# Altium schematic sheet ZhangXue.SchDoc
size A2
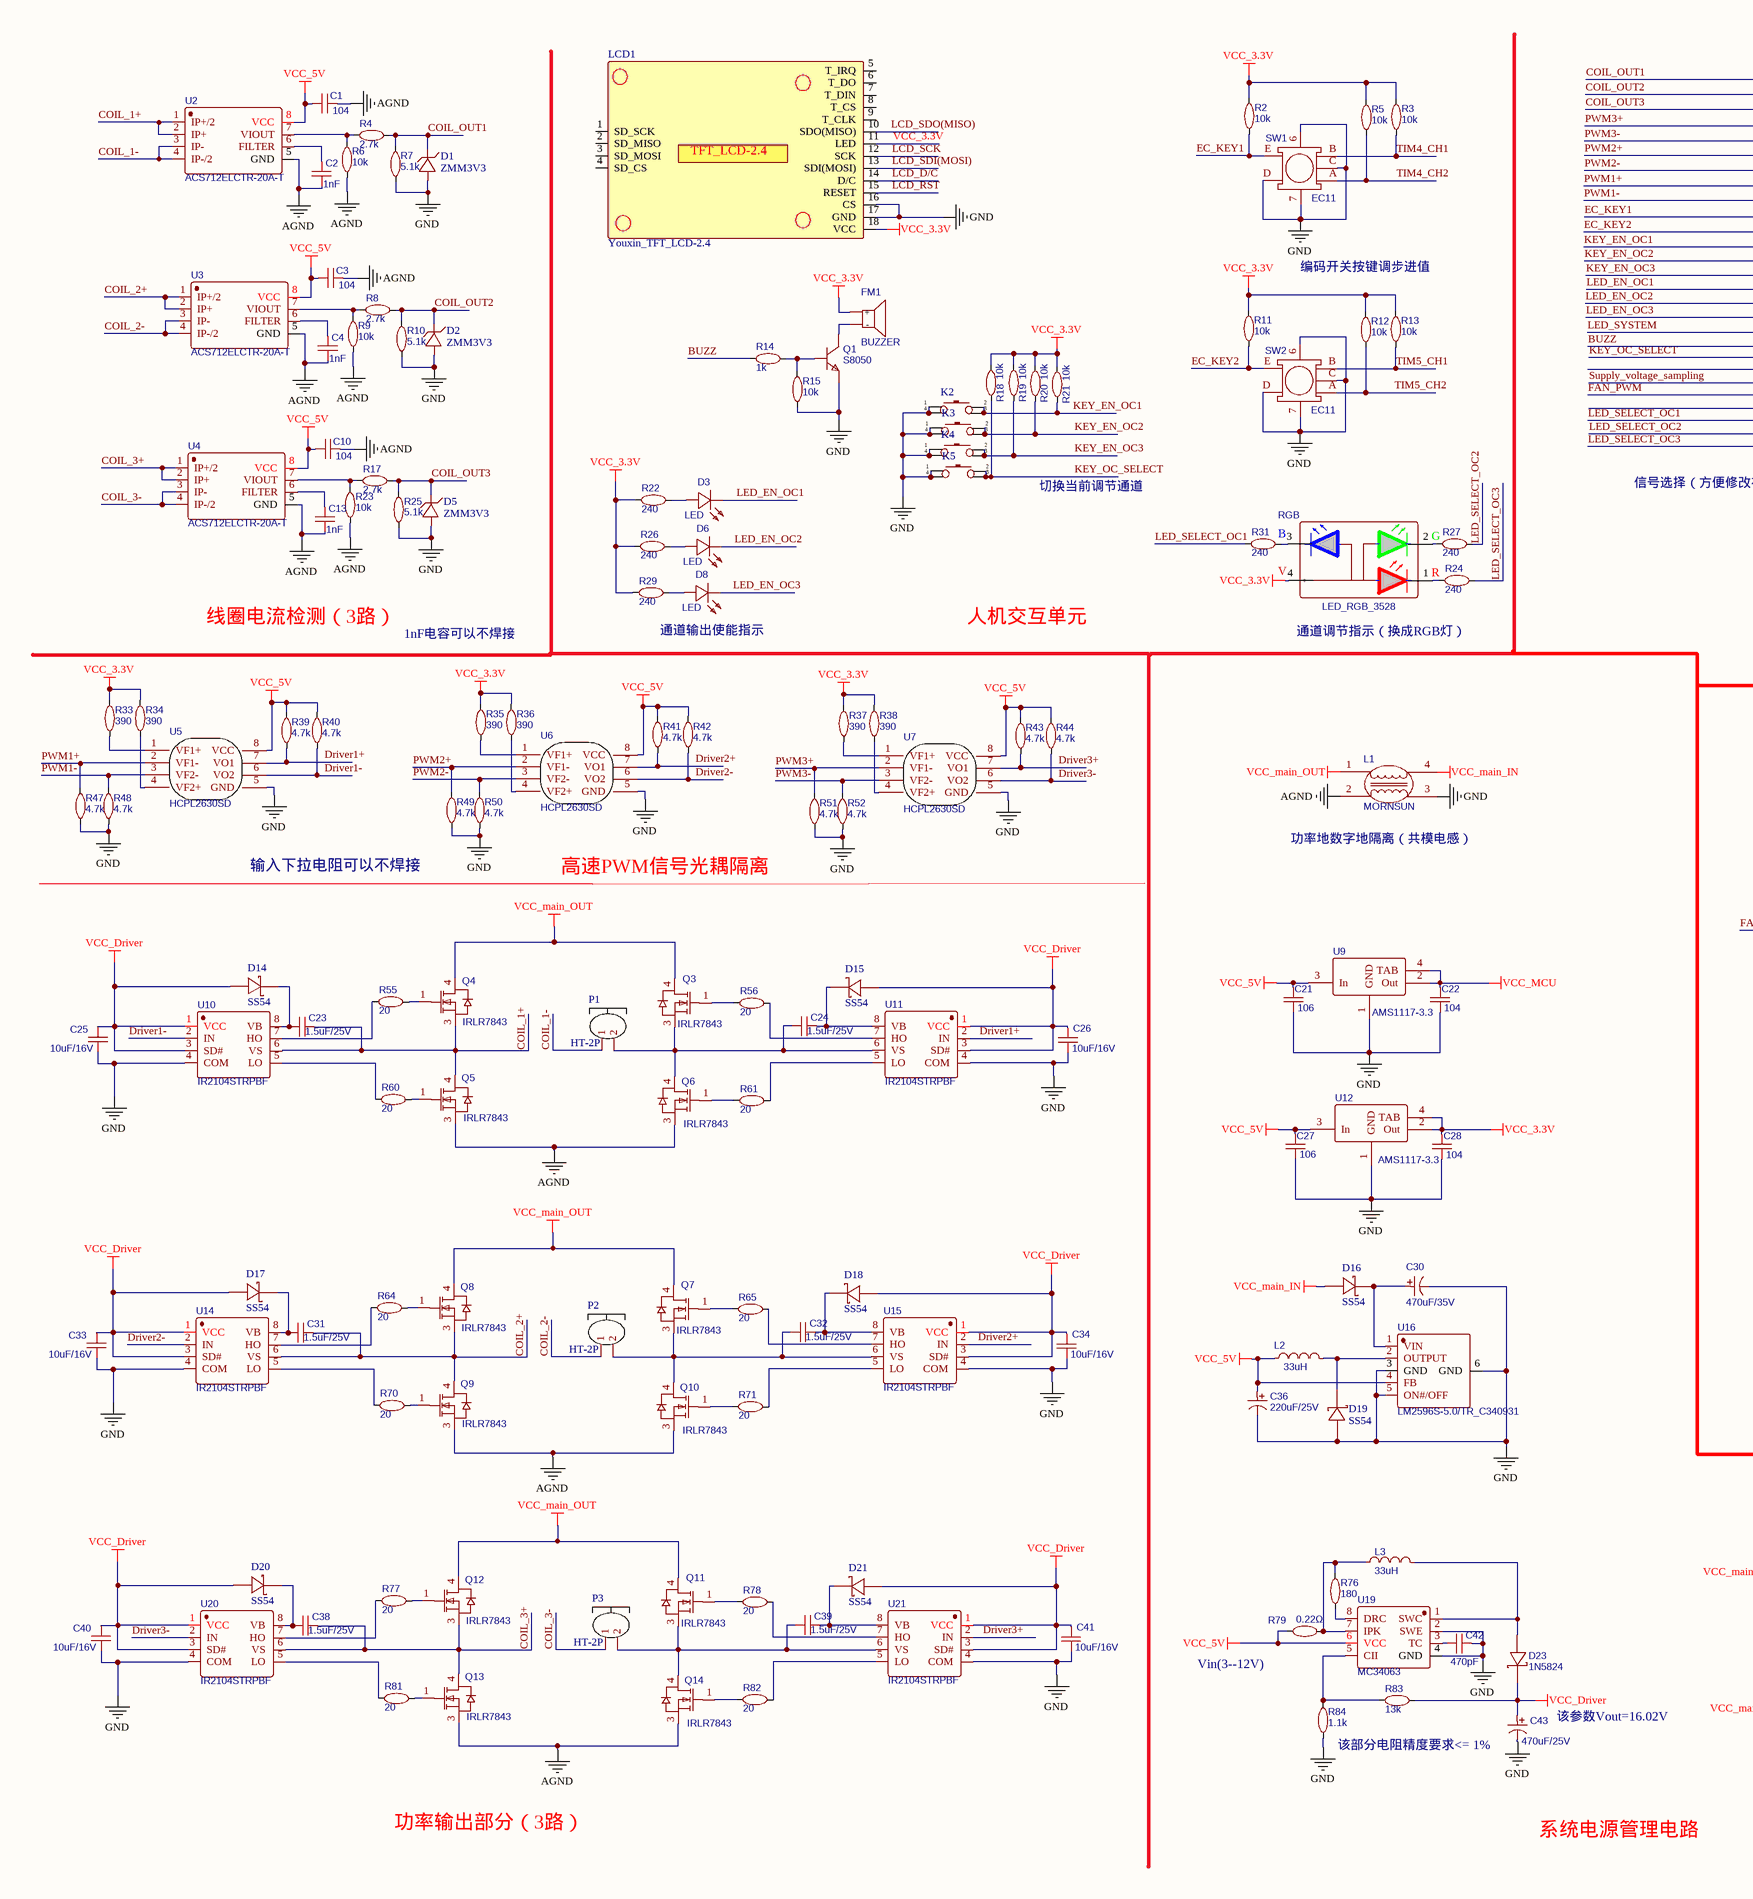
[diagram p0: ZhangXue.SchDoc, left]
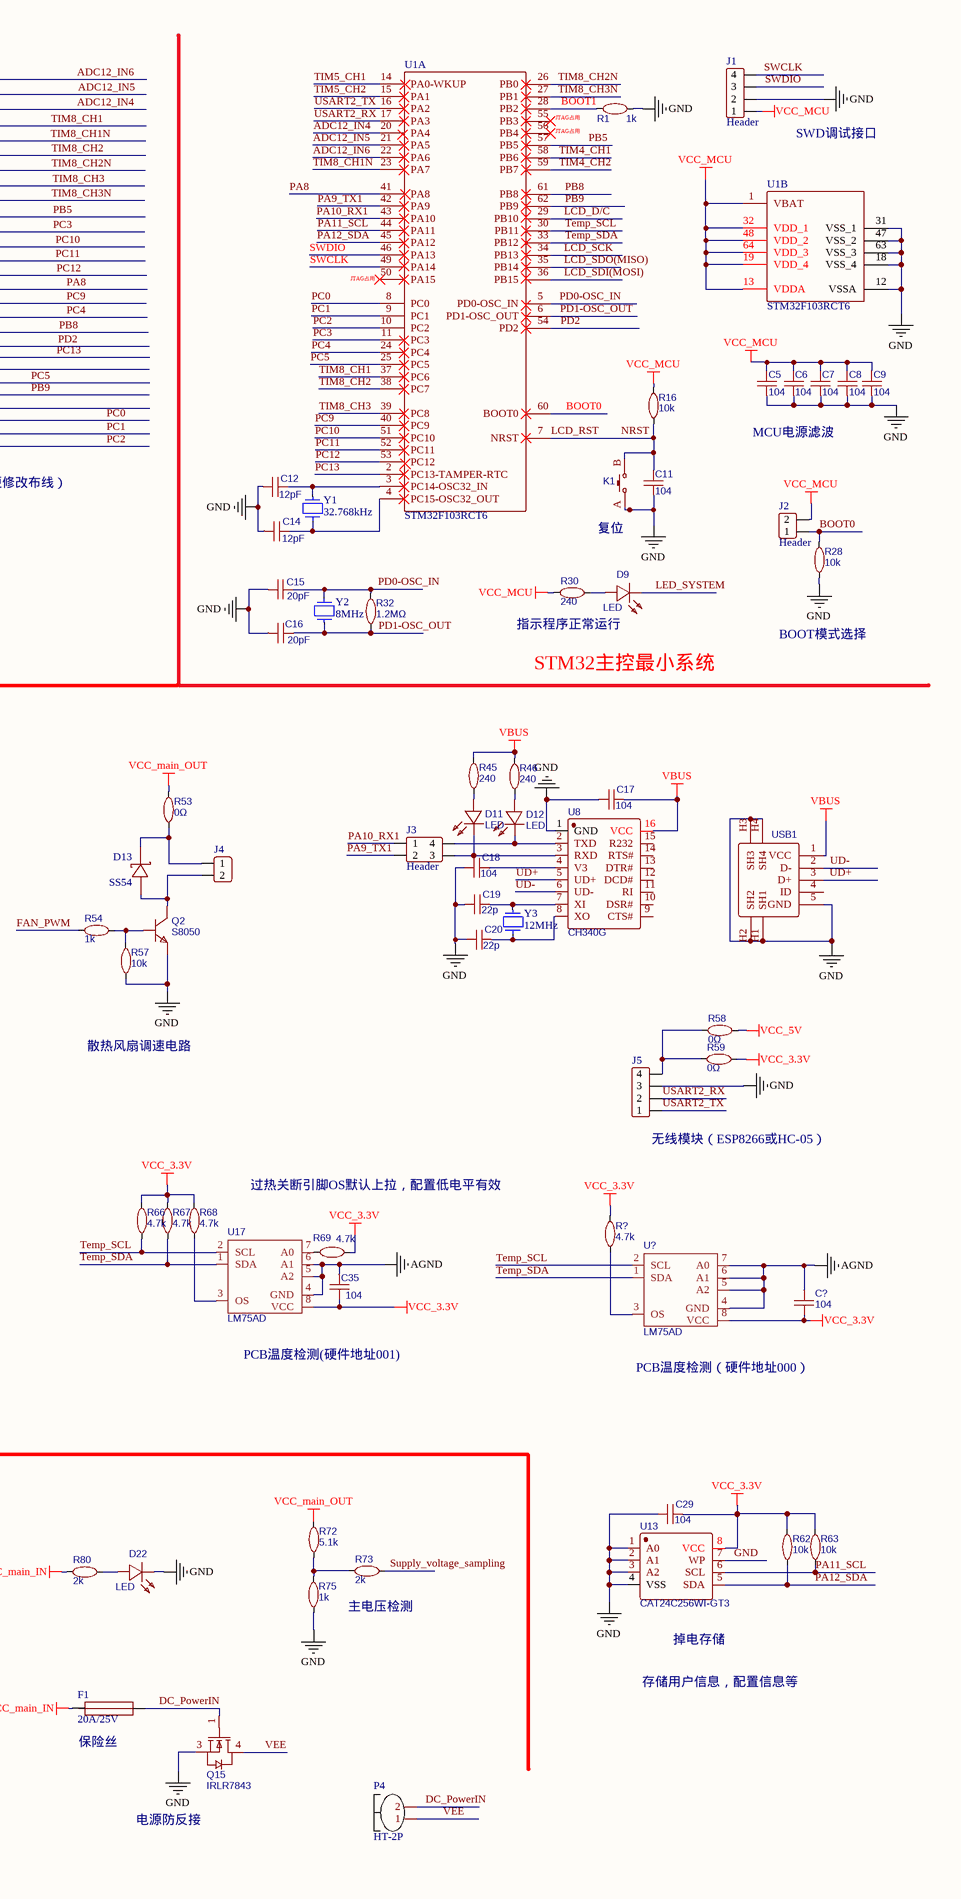
[diagram p1: ZhangXue.SchDoc, right]

## Parts
C1  104  [CAP_0603]
C2  1nF  [CAP_0603]
C3  104  [CAP_0603]
C4  1nF  [CAP_0603]
C5  104  [CAP_0603]
C6  104  [CAP_0603]
C7  104  [CAP_0603]
C8  104  [CAP_0603]
C9  104  [CAP_0603]
C10  104  [CAP_0603]
C11  104  [CAP_0603]
C12  12pF  [CAP_0603]
C13  1nF  [CAP_0603]
C14  12pF  [CAP_0603]
C15  20pF  [CAP_0603]
C16  20pF  [CAP_0603]
C17  104  [CAP_0603]
C18  104  [CAP_0603]
C19  22p  [CAP_0603]
C20  22p  [CAP_0603]
C21  106  [CAP_0603]
C22  104  [CAP_0603]
C23  1.5uF/25V  [CAP_0603]
C24  1.5uF/25V  [CAP_0603]
C25  10uF/16V  [CAP_0603]
C26  10uF/16V  [CAP_0603]
C27  106  [CAP_0603]
C28  104  [CAP_0603]
C29  104  [CAP_0603]
C30  470uF/35V  [CAPE_SMD_G_10.6]
C31  1.5uF/25V  [CAP_0603]
C32  1.5uF/25V  [CAP_0603]
C33  10uF/16V  [CAP_0603]
C34  10uF/16V  [CAP_0603]
C35  104  [CAP_0603]
C36  220uF/25V  [CAPE_SMD_F_8.4]
C38  1.5uF/25V  [CAP_0603]
C39  1.5uF/25V  [CAP_0603]
C40  10uF/16V  [CAP_0603]
C41  10uF/16V  [CAP_0603]
C42  470pF  [CAP_0805]
C43  470uF/25V  [CAPE_SMD_G_10.6]
C?  104  [CAP_0603]
D1  ZMM3V3  [LL34]
D2  ZMM3V3  [LL34]
D3  LED  [LED_0603_B]
D5  ZMM3V3  [LL34]
D6  LED  [LED_0603_B]
D8  LED  [LED_0603_B]
D9  LED  [LED_0603_B]
D11  LED  [LED_0603_B]
D12  LED  [LED_0603_B]
D13  SS54  [SOD-323]
D14  SS54  [SOD-323]
D15  SS54  [SOD-323]
D16  SS54  [DO214_SMA]
D17  SS54  [SOD-323]
D18  SS54  [SOD-323]
D19  SS54  [SOD-323]
D20  SS54  [SOD-323]
D21  SS54  [SOD-323]
D22  LED  [LED_0603_B]
D23  1N5824  [DO214_SMA]
F1  20A/25V  [FUSE-L]
FM1  BUZZER  [BUZZ-12*7.5]
J1  Header  [Header 2.54X4]
J2  Header  [Header 2.54X2]
J3  Header  [Header 2.54_2x2]
J4  Header  [HX2.54-2]  (value not drawn)
J5  Header 2.54_4  [Header F 2.54X4]  (value not drawn)
K1  TS-Button_2P  [SW_SMD_6.1*3.7]  (value not drawn)
K2  DIP-Button_4P  [TSW DIP-6*6*6]  (value not drawn)
K3  DIP-Button_4P  [TSW DIP-6*6*6]  (value not drawn)
K4  DIP-Button_4P  [TSW DIP-6*6*6]  (value not drawn)
K5  DIP-Button_4P  [TSW DIP-6*6*6]  (value not drawn)
L1  MORNSUN  [Inductor_Pin4]
L2  33uH  [Inductor_CDRH127R]
L3  33uH  [Inductor_CD_75]
LCD1  Youxin_TFT_LCD-2.4  [Youxin_TFT_LCD-2.4]
P1  HT-2P  [HT508-2P-H]
P2  HT-2P  [HT508-2P-H]
P3  HT-2P  [HT508-2P-H]
P4  HT-2P  [HT508-2P]
Q1  S8050  [SOT-23-3]
Q2  S8050  [SOT-23-3]
Q3  IRLR7843  [TO-252-2]
Q4  IRLR7843  [TO-252-2]
Q5  IRLR7843  [TO-252-2]
Q6  IRLR7843  [TO-252-2]
Q7  IRLR7843  [TO-252-2]
Q8  IRLR7843  [TO-252-2]
Q9  IRLR7843  [TO-252-2]
Q10  IRLR7843  [TO-252-2]
Q11  IRLR7843  [TO-252-2]
Q12  IRLR7843  [TO-252-2]
Q13  IRLR7843  [TO-252-2]
Q14  IRLR7843  [TO-252-2]
Q15  IRLR7843  [TO-252-2]
R1  1k  [RES_0603]
R2  10k  [RES_0603]
R3  10k  [RES_0603]
R4  2.7k  [RES_0603]
R5  10k  [RES_0603]
R6  10k  [RES_0603]
R7  5.1k  [RES_0603]
R8  2.7k  [RES_0603]
R9  10k  [RES_0603]
R10  5.1k  [RES_0603]
R11  10k  [RES_0603]
R12  10k  [RES_0603]
R13  10k  [RES_0603]
R14  1k  [RES_0603]
R15  10k  [RES_0603]
R16  10k  [RES_0603]
R17  2.7k  [RES_0603]
R18  10k  [RES_0603]
R19  10k  [RES_0603]
R20  10k  [RES_0603]
R21  10k  [RES_0603]
R22  240  [RES_0603]
R23  10k  [RES_0603]
R24  240  [RES_0603]
R25  5.1k  [RES_0603]
R26  240  [RES_0603]
R27  240  [RES_0603]
R28  10k  [RES_0603]
R29  240  [RES_0603]
R30  240  [RES_0603]
R31  240  [RES_0603]
R32  1.2MΩ  [RES_0603]
R33  390  [RES_0603]
R34  390  [RES_0603]
R35  390  [RES_0603]
R36  390  [RES_0603]
R37  390  [RES_0603]
R38  390  [RES_0603]
R39  4.7k  [RES_0603]
R40  4.7k  [RES_0603]
R41  4.7k  [RES_0603]
R42  4.7k  [RES_0603]
R43  4.7k  [RES_0603]
R44  4.7k  [RES_0603]
R45  240  [RES_0603]
R46  240  [RES_0603]
R47  4.7k  [RES_0603]
R48  4.7k  [RES_0603]
R49  4.7k  [RES_0603]
R50  4.7k  [RES_0603]
R51  4.7k  [RES_0603]
R52  4.7k  [RES_0603]
R53  0Ω  [RES_0603]
R54  1k  [RES_0603]
R55  20  [RES_0603]
R56  20  [RES_0603]
R57  10k  [RES_0603]
R58  0Ω  [RES_0603]
R59  0Ω  [RES_0603]
R60  20  [RES_0603]
R61  20  [RES_0603]
R62  10k  [RES_0603]
R63  10k  [RES_0603]
R64  20  [RES_0603]
R65  20  [RES_0603]
R66  4.7k  [RES_0603]
R67  4.7k  [RES_0603]
R68  4.7k  [RES_0603]
R69  4.7k  [RES_0603]
R70  20  [RES_0603]
R71  20  [RES_0603]
R72  5.1k  [RES_0603]
R73  2k  [RES_0603]
R75  1k  [RES_0603]
R76  180  [RES_0603]
R77  20  [RES_0603]
R78  20  [RES_0603]
R79  0.22Ω  [RES_0603]
R80  2k  [RES_0603]
R81  20  [RES_0603]
R82  20  [RES_0603]
R83  13k  [RES_0603]
R84  1.1k  [RES_0603]
R?  4.7k  [RES_0603]
RGB  LED_RGB_3528  [LED_3528_RGB]
SW1  EC11  [SW_EC11]
SW2  EC11  [SW_EC11]
U1  STM32F103RCT6  [LQFP_64_10X10]  (parts A,B of 2)
U2  ACS712ELCTR-20A-T  [SOIC-8_150MIL]
U3  ACS712ELCTR-20A-T  [SOIC-8_150MIL]
U4  ACS712ELCTR-20A-T  [SOIC-8_150MIL]
U5  HCPL2630SD  [SOP8_2_54]
U6  HCPL2630SD  [SOP8_2_54]
U7  HCPL2630SD  [SOP8_2_54]
U8  CH340G  [SOP-16]
U9  AMS1117-3.3  [SOT-223_3]
U10  IR2104STRPBF  [SOIC-8_150MIL]
U11  IR2104STRPBF  [SOIC-8_150MIL]
U12  AMS1117-3.3  [SOT-223_3]
U13  CAT24C256WI-GT3  [SOIC-8_150MIL]
U14  IR2104STRPBF  [SOIC-8_150MIL]
U15  IR2104STRPBF  [SOIC-8_150MIL]
U16  LM2596S-5.0/TR_C340931  [TO-263_5]
U17  LM75AD  [SOIC-8_150MIL]
U19  MC34063  [SOIC-8_150MIL]
U20  IR2104STRPBF  [SOIC-8_150MIL]
U21  IR2104STRPBF  [SOIC-8_150MIL]
U?  LM75AD  [SOIC-8_150MIL]
USB1  USB  [USB_Micro_DIP41]  (value not drawn)
Y1  32.768kHz  [X3215]
Y2  8MHz  [OSC-SMD_L5.0-W3.2]
Y3  12MHz  [XTAL1]

## Nets
AGND: C1.2 C2.1 C3.2 C4.1 C10.2 C13.1 C35.2 C?.2 L1.2 Q5.3(S) Q6.3(S) Q9.3(S) Q10.3(S) Q13.3(S) Q14.3(S) R6.1 R9.1 R23.1 U2.5(GND) U3.5(GND) U4.5(GND) U17.4(GND) U17.5(A2) U17.6(A1) U?.4(GND) U?.5(A2) U?.6(A1) U?.7(A0)
GND: C5.2 C6.2 C7.2 C8.2 C9.2 C11.2 C12.2 C14.2 C15.2 C16.2 C17.1 C18.1 C19.1 C20.1 C21.1 C22.1 C25.1 C26.1 C27.1 C28.1 C29.1 C30.2 C33.1 C34.1 C36.2 C40.1 C41.1 C42.2 C43.2 D1.1(A) D2.1(A) D5.1(A) D19.1(A) D22.C J1.2 J5.3 K1.A K2.1 K2.4 K3.1 K3.4 K4.1 K4.4 K5.1 K5.4 L1.3 LCD1.16(CS) LCD1.17(GND) Q1.2(E) Q2.2(E) Q15.3(S) R1.1 R7.2 R10.2 R15.2 R25.2 R28.2 R47.2 R48.2 R49.2 R50.2 R51.2 R52.2 R57.2 R75.1 R84.1 SW1.6 SW1.7 SW1.C SW1.D SW2.6 SW2.7 SW2.C SW2.D U1.12(VSSA) U1.18(VSS_4) U1.31(VSS_1) U1.47(VSS_2) U1.63(VSS_3) U5.5(GND) U6.5(GND) U7.5(GND) U8.1(GND) U9.1(GND) U10.4(COM) U11.4(COM) U12.1(GND) U13.1(A0) U13.2(A1) U13.3(A2) U13.4(VSS) U13.7(WP) U14.4(COM) U15.4(COM) U16.3(GND) U16.5(ON#/OFF) U16.6(GND) U19.2(SWE) U19.4(GND) U20.4(COM) U21.4(COM) USB1.5(GND) USB1.H1(SH1) USB1.H2(SH2) USB1.H3(SH3) USB1.H4(SH4)
VBUS: C17.2 R45.2 R46.2 U8.16(VCC) USB1.1(VCC)
VCC_3.3V: C28.2 C29.2 C35.1 C?.1 FM1.1(+) LCD1.11(LED) LCD1.18(VCC) R2.1 R3.1 R5.1 R11.1 R12.1 R13.1 R18.1 R19.1 R20.1 R21.1 R22.1 R26.1 R29.1 R33.1 R34.1 R35.1 R36.1 R37.1 R38.1 R59.1 R62.2 R63.2 R66.2 R67.2 R68.2 R69.1 R?.2 RGB.4 U12.2(Out) U12.4(TAB) U13.8(VCC) U17.8(VCC) U?.8(VCC)
VCC_5V: C1.1 C3.1 C10.1 C21.2 C27.2 C36.1 L2.1 R39.1 R40.1 R41.1 R42.1 R43.1 R44.1 R58.1 R79.2 U2.8(VCC) U3.8(VCC) U4.8(VCC) U5.8(VCC) U6.8(VCC) U7.8(VCC) U9.3(In) U12.3(In) U16.4(FB) U19.6(VCC)
VCC_Driver: C25.2 C26.2 C33.2 C34.2 C40.2 C41.2 C43.1 D14.1(A) D15.1(A) D17.1(A) D18.1(A) D20.1(A) D21.1(A) D23.2(C) R83.2 U10.1(VCC) U10.3(SD#) U11.1(VCC) U11.3(SD#) U14.1(VCC) U14.3(SD#) U15.1(VCC) U15.3(SD#) U20.1(VCC) U20.3(SD#) U21.1(VCC) U21.3(SD#)
VCC_main_IN: D16.1(A) F1.2 L1.4 R80.1
VCC_main_OUT: L1.1 Q3.4(D) Q4.4(D) Q7.4(D) Q8.4(D) Q11.4(D) Q12.4(D) R53.2 R72.2
VCC_MCU: C5.1 C6.1 C7.1 C8.1 C9.1 C22.2 J1.1 J2.2 R16.2 R30.1 U1.1(VBAT) U1.13(VDDA) U1.19(VDD_4) U1.32(VDD_1) U1.48(VDD_2) U1.64(VDD_3) U9.2(Out) U9.4(TAB)
ADC12_IN4: D5.2(C) R17.1 R25.1 U1.20(PA4)  [also labelled COIL_OUT3]
ADC12_IN5: D2.2(C) R8.1 R10.1 U1.21(PA5)  [also labelled COIL_OUT2]
ADC12_IN6: D1.2(C) R4.1 R7.1 U1.22(PA6)  [also labelled COIL_OUT1]
BOOT0: J2.1 R28.1 U1.60(BOOT0)
BOOT1: R1.2 U1.28(PB2)
BUZZ: R14.1 U1.54(PD2)  [also labelled PD2]
COIL_1+: C23.2 Q4.3(S) Q5.4(D) U2.1(IP+/2) U2.2(IP+) U10.6(VS)
COIL_1-: P1.1 U2.3(IP-) U2.4(IP-/2)
COIL_2+: C31.2 Q8.3(S) Q9.4(D) U3.1(IP+/2) U3.2(IP+) U14.6(VS)
COIL_2-: P2.1 U3.3(IP-) U3.4(IP-/2)
COIL_3+: C38.2 Q12.3(S) Q13.4(D) U4.1(IP+/2) U4.2(IP+) U20.6(VS)
COIL_3-: P3.1 U4.3(IP-) U4.4(IP-/2)
DC_PowerIN: F1.1 P4.2 Q15.1(G)
Driver1+: R39.2 U5.7(VO1) U11.2(IN)
Driver1-: R40.2 U5.6(VO2) U10.2(IN)
Driver2+: R41.2 U6.7(VO1) U15.2(IN)
Driver2-: R42.2 U6.6(VO2) U14.2(IN)
Driver3+: R43.2 U7.7(VO1) U21.2(IN)
Driver3-: R44.2 U7.6(VO2) U20.2(IN)
EC_KEY1: R2.2 SW1.E U1.57(PB5)  [also labelled PB5]
EC_KEY2: R11.2 SW2.E U1.11(PC3)  [also labelled PC3]
FAN_PWM: R54.1 U1.62(PB9)  [also labelled PB9]
KEY_EN_OC1: K2.2 K2.3 R21.2 U1.51(PC10)  [also labelled PC10]
KEY_EN_OC2: K3.2 K3.3 R20.2 U1.52(PC11)  [also labelled PC11]
KEY_EN_OC3: K4.2 K4.3 R19.2 U1.53(PC12)  [also labelled PC12]
KEY_OC_SELECT: K5.2 K5.3 R18.2 U1.2(PC13-TAMPER-RTC)  [also labelled PC13]
LCD_D/C: LCD1.14(D/C) U1.29(PB10)
LCD_RST: C11.1 K1.B LCD1.15(RESET) R16.1 U1.7(NRST)  [also labelled NRST]
LCD_SCK: LCD1.12(SCK) U1.34(PB13)
LCD_SDI(MOSI): LCD1.13(SDI(MOSI)) U1.36(PB15)
LCD_SDO(MISO): LCD1.10(SDO(MISO)) U1.35(PB14)
LED_EN_OC1: D3.C U1.41(PA8)  [also labelled PA8]
LED_EN_OC2: D6.C U1.40(PC9)  [also labelled PC9]
LED_EN_OC3: D8.C U1.24(PC4)  [also labelled PC4]
LED_SELECT_OC1: R31.1 U1.8(PC0)  [also labelled PC0]
LED_SELECT_OC2: R27.2 U1.9(PC1)  [also labelled PC1]
LED_SELECT_OC3: R24.2 U1.10(PC2)  [also labelled PC2]
LED_SYSTEM: D9.C U1.61(PB8)  [also labelled PB8]
PA9_TX1: J3.2 U1.42(PA9)
PA10_RX1: J3.1 U1.43(PA10)
PA11_SCL: R63.1 U1.44(PA11) U13.6(SCL)
PA12_SDA: R62.1 U1.45(PA12) U13.5(SDA)
PC5: R73.1 U1.25(PC5)  [also labelled Supply_voltage_sampling]
PD0-OSC_IN: C15.1 R32.1 U1.5(PD0-OSC_IN) Y2.2
PD1-OSC_OUT: C16.1 R32.2 U1.6(PD1-OSC_OUT) Y2.1
PWM1+: R47.1 U1.39(PC8) U5.2(VF1-)  [also labelled TIM8_CH3]
PWM1-: R48.1 U1.27(PB1) U5.3(VF2-)  [also labelled TIM8_CH3N]
PWM2+: R49.1 U1.38(PC7) U6.2(VF1-)  [also labelled TIM8_CH2]
PWM2-: R50.1 U1.26(PB0) U6.3(VF2-)  [also labelled TIM8_CH2N]
PWM3+: R51.1 U1.37(PC6) U7.2(VF1-)  [also labelled TIM8_CH1]
PWM3-: R52.1 U1.23(PA7) U7.3(VF2-)  [also labelled TIM8_CH1N]
SWCLK: J1.4 U1.49(PA14)
SWDIO: J1.3 U1.46(PA13)
Temp_SCL: R66.1 U1.30(PB11) U17.2(SCL) U?.2(SCL)
Temp_SDA: R67.1 U1.33(PB12) U17.1(SDA) U?.1(SDA)
TIM4_CH1: R3.2 SW1.B U1.58(PB6)
TIM4_CH2: R5.2 SW1.A U1.59(PB7)
TIM5_CH1: R13.2 SW2.B U1.14(PA0-WKUP)
TIM5_CH2: R12.2 SW2.A U1.15(PA1)
UD+: U8.5(UD+) USB1.3(D+)
UD-: U8.6(UD-) USB1.2(D-)
USART2_RX: J5.2 U1.17(PA3)
USART2_TX: J5.1 U1.16(PA2)
VEE: P4.1 Q15.4(D)
NetC2_2: C2.2 U2.6(FILTER)
NetC4_2: C4.2 U3.6(FILTER)
NetC12_1: C12.1 U1.3(PC14-OSC32_IN) Y1.1
NetC13_2: C13.2 U4.6(FILTER)
NetC14_1: C14.1 U1.4(PC15-OSC32_OUT) Y1.2
NetC18_2: C18.2 U8.4(V3)
NetC19_2: C19.2 U8.7(XI) Y3.1
NetC20_2: C20.2 U8.8(XO) Y3.2
NetC23_1: C23.1 D14.2(C) U10.8(VB)
NetC24_1: C24.1 P1.2 Q3.3(S) Q6.4(D) U11.6(VS)
NetC24_2: C24.2 D15.2(C) U11.8(VB)
NetC30_1: C30.1 D16.2(C) U16.1(VIN)
NetC31_1: C31.1 D17.2(C) U14.8(VB)
NetC32_1: C32.1 P2.2 Q7.3(S) Q10.4(D) U15.6(VS)
NetC32_2: C32.2 D18.2(C) U15.8(VB)
NetC38_1: C38.1 D20.2(C) U20.8(VB)
NetC39_1: C39.1 P3.2 Q11.3(S) Q14.4(D) U21.6(VS)
NetC39_2: C39.2 D21.2(C) U21.8(VB)
NetC42_1: C42.1 U19.3(TC)
NetD3_A: D3.A R22.2
NetD6_A: D6.A R26.2
NetD8_A: D8.A R29.2
NetD9_A: D9.A R30.2
NetD11_A: D11.A R45.1
NetD11_C: D11.C J3.3 U8.3(RXD)
NetD12_A: D12.A R46.1
NetD12_C: D12.C J3.4 U8.2(TXD)
NetD13_1: D13.1(A) J4.2 Q2.3(C)
NetD13_2: D13.2(C) J4.1 R53.1
NetD19_2: D19.2(C) L2.2 U16.2(OUTPUT)
NetD22_A: D22.A R80.2
NetD23_1: D23.1(A) L3.2 U19.1(SWC)
NetFM1_2: FM1.2(－) Q1.3(C)
NetJ5_4: J5.4 R58.2 R59.2
NetL3_1: L3.1 R76.2 R79.1 U19.7(IPK)
NetQ1_1: Q1.1(B) R14.2 R15.1
NetQ2_1: Q2.1(B) R54.2 R57.1
NetQ3_1: Q3.1(G) R56.2
NetQ4_1: Q4.1(G) R55.1
NetQ5_1: Q5.1(G) R60.1
NetQ6_1: Q6.1(G) R61.2
NetQ7_1: Q7.1(G) R65.2
NetQ8_1: Q8.1(G) R64.1
NetQ9_1: Q9.1(G) R70.1
NetQ10_1: Q10.1(G) R71.2
NetQ11_1: Q11.1(G) R78.2
NetQ12_1: Q12.1(G) R77.1
NetQ13_1: Q13.1(G) R81.1
NetQ14_1: Q14.1(G) R82.2
NetR4_2: R4.2 R6.2 U2.7(VIOUT)
NetR8_2: R8.2 R9.2 U3.7(VIOUT)
NetR17_2: R17.2 R23.2 U4.7(VIOUT)
NetR24_1: R24.1 RGB.1
NetR27_1: R27.1 RGB.2
NetR31_2: R31.2 RGB.3
NetR33_2: R33.2 U5.1(VF1+)
NetR34_2: R34.2 U5.4(VF2+)
NetR35_2: R35.2 U6.1(VF1+)
NetR36_2: R36.2 U6.4(VF2+)
NetR37_2: R37.2 U7.1(VF1+)
NetR38_2: R38.2 U7.4(VF2+)
NetR55_2: R55.2 U10.7(HO)
NetR56_1: R56.1 U11.7(HO)
NetR60_2: R60.2 U10.5(LO)
NetR61_1: R61.1 U11.5(LO)
NetR64_2: R64.2 U14.7(HO)
NetR65_1: R65.1 U15.7(HO)
NetR68_1: R68.1 U17.3(OS)
NetR69_2: R69.2 U17.7(A0)
NetR70_2: R70.2 U14.5(LO)
NetR71_1: R71.1 U15.5(LO)
NetR72_1: R72.1 R73.2 R75.2
NetR76_1: R76.1 U19.8(DRC)
NetR77_2: R77.2 U20.7(HO)
NetR78_1: R78.1 U21.7(HO)
NetR81_2: R81.2 U20.5(LO)
NetR82_1: R82.1 U21.5(LO)
NetR83_1: R83.1 R84.2 U19.5(CII)
NetR?_1: R?.1 U?.3(OS)

Not connected (* = marked no-connect by the designer): LCD1 1(SD_SCK) 2(SD_MISO) 3(SD_MOSI) 4(SD_CS) 5(T_IRQ) 6(T_DO) 7(T_DIN) 8(T_CS) 9(T_CLK); U1 50(PA15)* 55(PB3)* 56(PB4)*; U8 9(CTS#) 10(DSR#) 11(RI) 12(DCD#) 13(DTR#) 14(RTS#) 15(R232); USB1 4(ID)

## Notes on the sheet
- JTAG占用
- SWD调试接口
- 编码开关按键调步进值
- (near U1) JTAG占用
- MCU电源滤波
- 切换当前调节通道
- 信号选择（方便修改布线）
- (near K1) 复位
- 线圈电流检测（3路）
- 1nF电容可以不焊接
- 通道输出使能指示
- 人机交互单元
- (near RGB) 通道调节指示（换成RGB灯）
- (near R30) 指示程序正常运行
- BOOT模式选择
- STM32主控最小系统
- 输入下拉电阻可以不焊接
- 高速PWM信号光耦隔离
- (near L1) 功率地数字地隔离（共模电感）
- 散热风扇调速电路
- 过热关断引脚OS默认上拉，配置低电平有效
- (near J5) 无线模块（ESP8266或HC-05）
- PCB温度检测(硬件地址001)
- (near U?) PCB温度检测（硬件地址000）
- 主电压检测
- (near R79) Vin(3--12V)
- 存储用户信息，配置信息等
- 掉电存储
- 该参数Vout=16.02V
- (near F1) 保险丝
- (near R84) 该部分电阻精度要求<= 1%
- 功率输出部分（3路）
- 系统电源管理电路
- 电源防反接
- (in symbol LED_RGB_3528) B; G; V; R
- (in symbol Youxin_TFT_LCD-2.4) TFT_LCD-2.4

## Library data of the parts
C1-C29 C31-C35 C38-C41 C? = CAP_0603: BOM_Manufacturer: Samsung Electro-Mechanics; BOM_Manufacturer Part: CL10B104KB8WPNC; nameAlias: Capacitance; Contributor: LCSC; BOM_Supplier: LCSC; BOM_Supplier Part: C307348; spicePre: C; spiceSymbolName: CL10B104KB8WPNC
C30 C36 C43 = CAP_E_SMD: 贴片电解电容; BOM_Manufacturer: ROQANG; BOM_Manufacturer Part: RVT1C221M0607; nameAlias: Capacitance; BOM_Supplier: LCSC; BOM_Supplier Part: C72496; spicePre: C; spiceSymbolName: RVT1C221M0607
C42 = CAP_0805: BOM_Manufacturer: Samsung Electro-Mechanics; BOM_Manufacturer Part: CL10B104KB8WPNC; nameAlias: Capacitance; Contributor: LCSC; BOM_Supplier: LCSC; BOM_Supplier Part: C307348; spicePre: C; spiceSymbolName: CL10B104KB8WPNC
D3 D6 D8 D9 D11 D12 D22 = LED_0603: 发光LED; BOM_Manufacturer: ARKLED; BOM_Manufacturer Part: D-G080508G1; Contributor: LCSC; BOM_Supplier: LCSC; BOM_Supplier Part: C107402; spicePre: L; spiceSymbolName: D-G080508G1
D13-D21 = SS54: 1N5819
D23 = 1N5824: 肖特基二极管; BOM_Manufacturer: KEXIN; BOM_Manufacturer Part: 1N5819; Contributor: LCSC; BOM_Supplier: LCSC; BOM_Supplier Part: C437199; spicePre: D; spiceSymbolName: 1N5819_C437199
F1 = FUSH: 保险丝
FM1 = BUZZER: 蜂鸣器; BOM_Manufacturer: HNDZ; BOM_Manufacturer Part: TMB12A12; BOM_Supplier: LCSC; BOM_Supplier Part: C96079; spicePre: B; spiceSymbolName: TMB12A12
J1 = Header 2.54_4
J2 J4 = Header 2.54_2
J3 = Header 2.54_2X2
K1 = TS-Button_2P_1: 贴片按键 3*6*2.5; BOM_Manufacturer: XUNPU; BOM_Manufacturer Part: TS-1007S-26; Contributor: LCSC; BOM_Supplier: LCSC; BOM_Supplier Part: C455236; spicePre: S; spiceSymbolName: TS-1007S-26
K2-K5 = DIP-Button_4P: 按键，直插，6*6*6
L1 = MORNSUN: 共模电感; BOM_Manufacturer: MORNSUN Guangzhou S& T; BOM_Manufacturer Part: FL2D-30-102; nameAlias: Value; Contributor: LCSC; BOM_Supplier: LCSC; BOM_Supplier Part: C194629; spicePre: L; spiceSymbolName: FL2D-30-102
L2 L3 = Inductor: BOM_Manufacturer: TDK; BOM_Manufacturer Part: NLV25T-330J-EF; nameAlias: Inductance; Contributor: LCSC; BOM_Supplier: LCSC; BOM_Supplier Part: C295130; spicePre: L; spiceSymbolName: NLV25T-330J-EF
P1-P4 = HT端子-2P
Q1 Q2 = S8050: 三极管NPN; BOM_Manufacturer: FH; BOM_Manufacturer Part: FHT9014Y-ME; SMT Type: Extend; BOM_Supplier: LCSC; BOM_Supplier Part: C88861; BOM_LCSC Assembly: Yes; spicePre: Q; spiceSymbolName: FHT9014Y-ME
Q3-Q15 = IRLR7843TRPBF: MOS管; BOM_Manufacturer: IR; SMT Type: Extend; BOM_Supplier: LCSC; BOM_Manufacturer Part: IRLR7843TRPBF; image: //image.lceda.cn/szlcsc/C21988.jpg; BOM_Supplier Part: C21988; BOM_LCSC Assembly: Yes; spicePre: Q; spiceSymbolName: IRLR7843TRPBF
R1-R73 R75-R84 R? = RES_0603: BOM_Manufacturer: YAGEO; BOM_Manufacturer Part: RC0402JR-07100KL; nameAlias: Resistance (Ohms); BOM_Supplier: LCSC; BOM_Supplier Part: C106234; spicePre: R; spiceSymbolName: RC0402JR-07100KL
RGB = LED_RGB_3528: BOM_Manufacturer: NATIONSTAR; BOM_Manufacturer Part: FM-3528RGBA-HF; Contributor: LCSC; BOM_Supplier: LCSC; BOM_Supplier Part: C108539; spicePre: L; spiceSymbolName: FM-3528RGBA-HF
SW1 SW2 = EC11E153440D: BOM_Manufacturer: ALPS Electric; Contributor: LCSC; BOM_Supplier: LCSC; BOM_Supplier Part: C370992; BOM_Manufacturer Part: EC11E153440D; spicePre: S; spiceSymbolName: EC11E153440D
U2-U4 = ACS712ELCTR-20A-T: BOM_Manufacturer: ALLEGRO; SMT Type: Basic; spicePre: X; BOM_Supplier: LCSC; BOM_Manufacturer Part: ACS712ELCTR-20A-T; BOM_LCSC Assembly: Yes; image: //image.lceda.cn/szlcsc/C10681.jpg; BOM_Supplier Part: C10681; spiceSymbolName: ACS712ELCTR-20A-T
U5-U7 = HCPL2630SD: BOM_Manufacturer: FAIRCHILD; BOM_Supplier: LCSC; BOM_Manufacturer Part: HCPL2630SD; image: //image.lceda.cn/szlcsc/C46037.jpg; BOM_Supplier Part: C46037; spicePre: U; spiceSymbolName: HCPL2630SD
U8 = CH340G: BOM_Manufacturer: WCH; SMT Type: Basic; timeStamp: 1468327462; BOM_Supplier: LCSC; BOM_Manufacturer Part: CH340G; BOM_LCSC Assembly: Yes; image: //image.lceda.cn/szlcsc/C14267.jpg; BOM_Supplier Part: C14267; spicePre: U; spiceSymbolName: CH340G
U9 U12 = AMS1117-3.3: BOM_Manufacturer: SK; Contributor: LCSC; SMT Type: Extend; BOM_Supplier: LCSC; BOM_Supplier Part: C165482; BOM_Manufacturer Part: AMS1117-3.3; BOM_LCSC Assembly: Yes; spicePre: U; spiceSymbolName: AMS1117-3.3_C165482
U10 U11 U14 U15 U20 U21 = IR2104STRPBF: 半桥驱动; BOM_Manufacturer: IR; SMT Type: Extend; spicePre: X; BOM_Supplier: LCSC; BOM_Manufacturer Part: IR2104STRPBF; image: //image.lceda.cn/szlcsc/C2960.jpg; BOM_Supplier Part: C2960; BOM_LCSC Assembly: Yes; spiceSymbolName: IR2104STRPBF
U13 = CAT24C256WI-GT3: BOM_Manufacturer: ON; SMT Type: Extend; BOM_Supplier: LCSC; BOM_Manufacturer Part: CAT24C256WI-GT3; image: //image.lceda.cn/szlcsc/C79987.jpg; BOM_Supplier Part: C79987; BOM_LCSC Assembly: Yes; spicePre: U; spiceSymbolName: CAT24C256WI-GT3
U16 = LM2596S-5.0/TR_C340931: BOM_Manufacturer: Huaguan Semicon; Contributor: LCSC; BOM_Supplier: LCSC; BOM_Supplier Part: C340931; BOM_Manufacturer Part: LM2596S-5.0/TR; spicePre: U; spiceSymbolName: LM2596S-5.0/TR_C340931
U17 U? = LM75AD: BOM_Manufacturer: NXP; SMT Type: Extend; BOM_Supplier: LCSC; BOM_Manufacturer Part: LM75AD; image: //image.lceda.cn/szlcsc/C7963.jpg; BOM_Supplier Part: C7963; BOM_LCSC Assembly: Yes; spicePre: U; spiceSymbolName: LM75AD
U19 = MC34063: BOM_Manufacturer: STMicroelectronics; BOM_Manufacturer Part: MC34063ACN; Contributor: LCSC; BOM_Supplier: LCSC; BOM_Supplier Part: C283638; spicePre: U; spiceSymbolName: MC34063ACN
USB1 = MicroUSB: BOM_Manufacturer: SHOU HAN; BOM_Manufacturer Part: MicroXNJ; Contributor: LCSC; BOM_Supplier: LCSC; BOM_Supplier Part: C404969; spicePre: U; spiceSymbolName: MICROXNJ
Y1-Y3 = XTAL-2: 晶振